# Altium schematic sheet FIT_FPGA_A-C.SchDoc: FIT_PM12 board
size 420 x 297 mm; CheckedBy: G.Kasprowicz; Author: INR Moscow; CompanyName: WUT ISE; DrawnBy: M.Podgórski; Organization: WUT ISE; Address1: PW ISE; Address2: Nowowiejska 15/19 00-665 Warsaw; Address3: gkasprow@gmail.com; Revision: 2; SheetNumber: -; SheetTotal: -; ModifiedBy: -; CheckedDate: -; Title2: Title 2; DivGrp: WUT ISE; Designer: INR RAS; ModifiedDate: -; ProjectName: Sensor Box
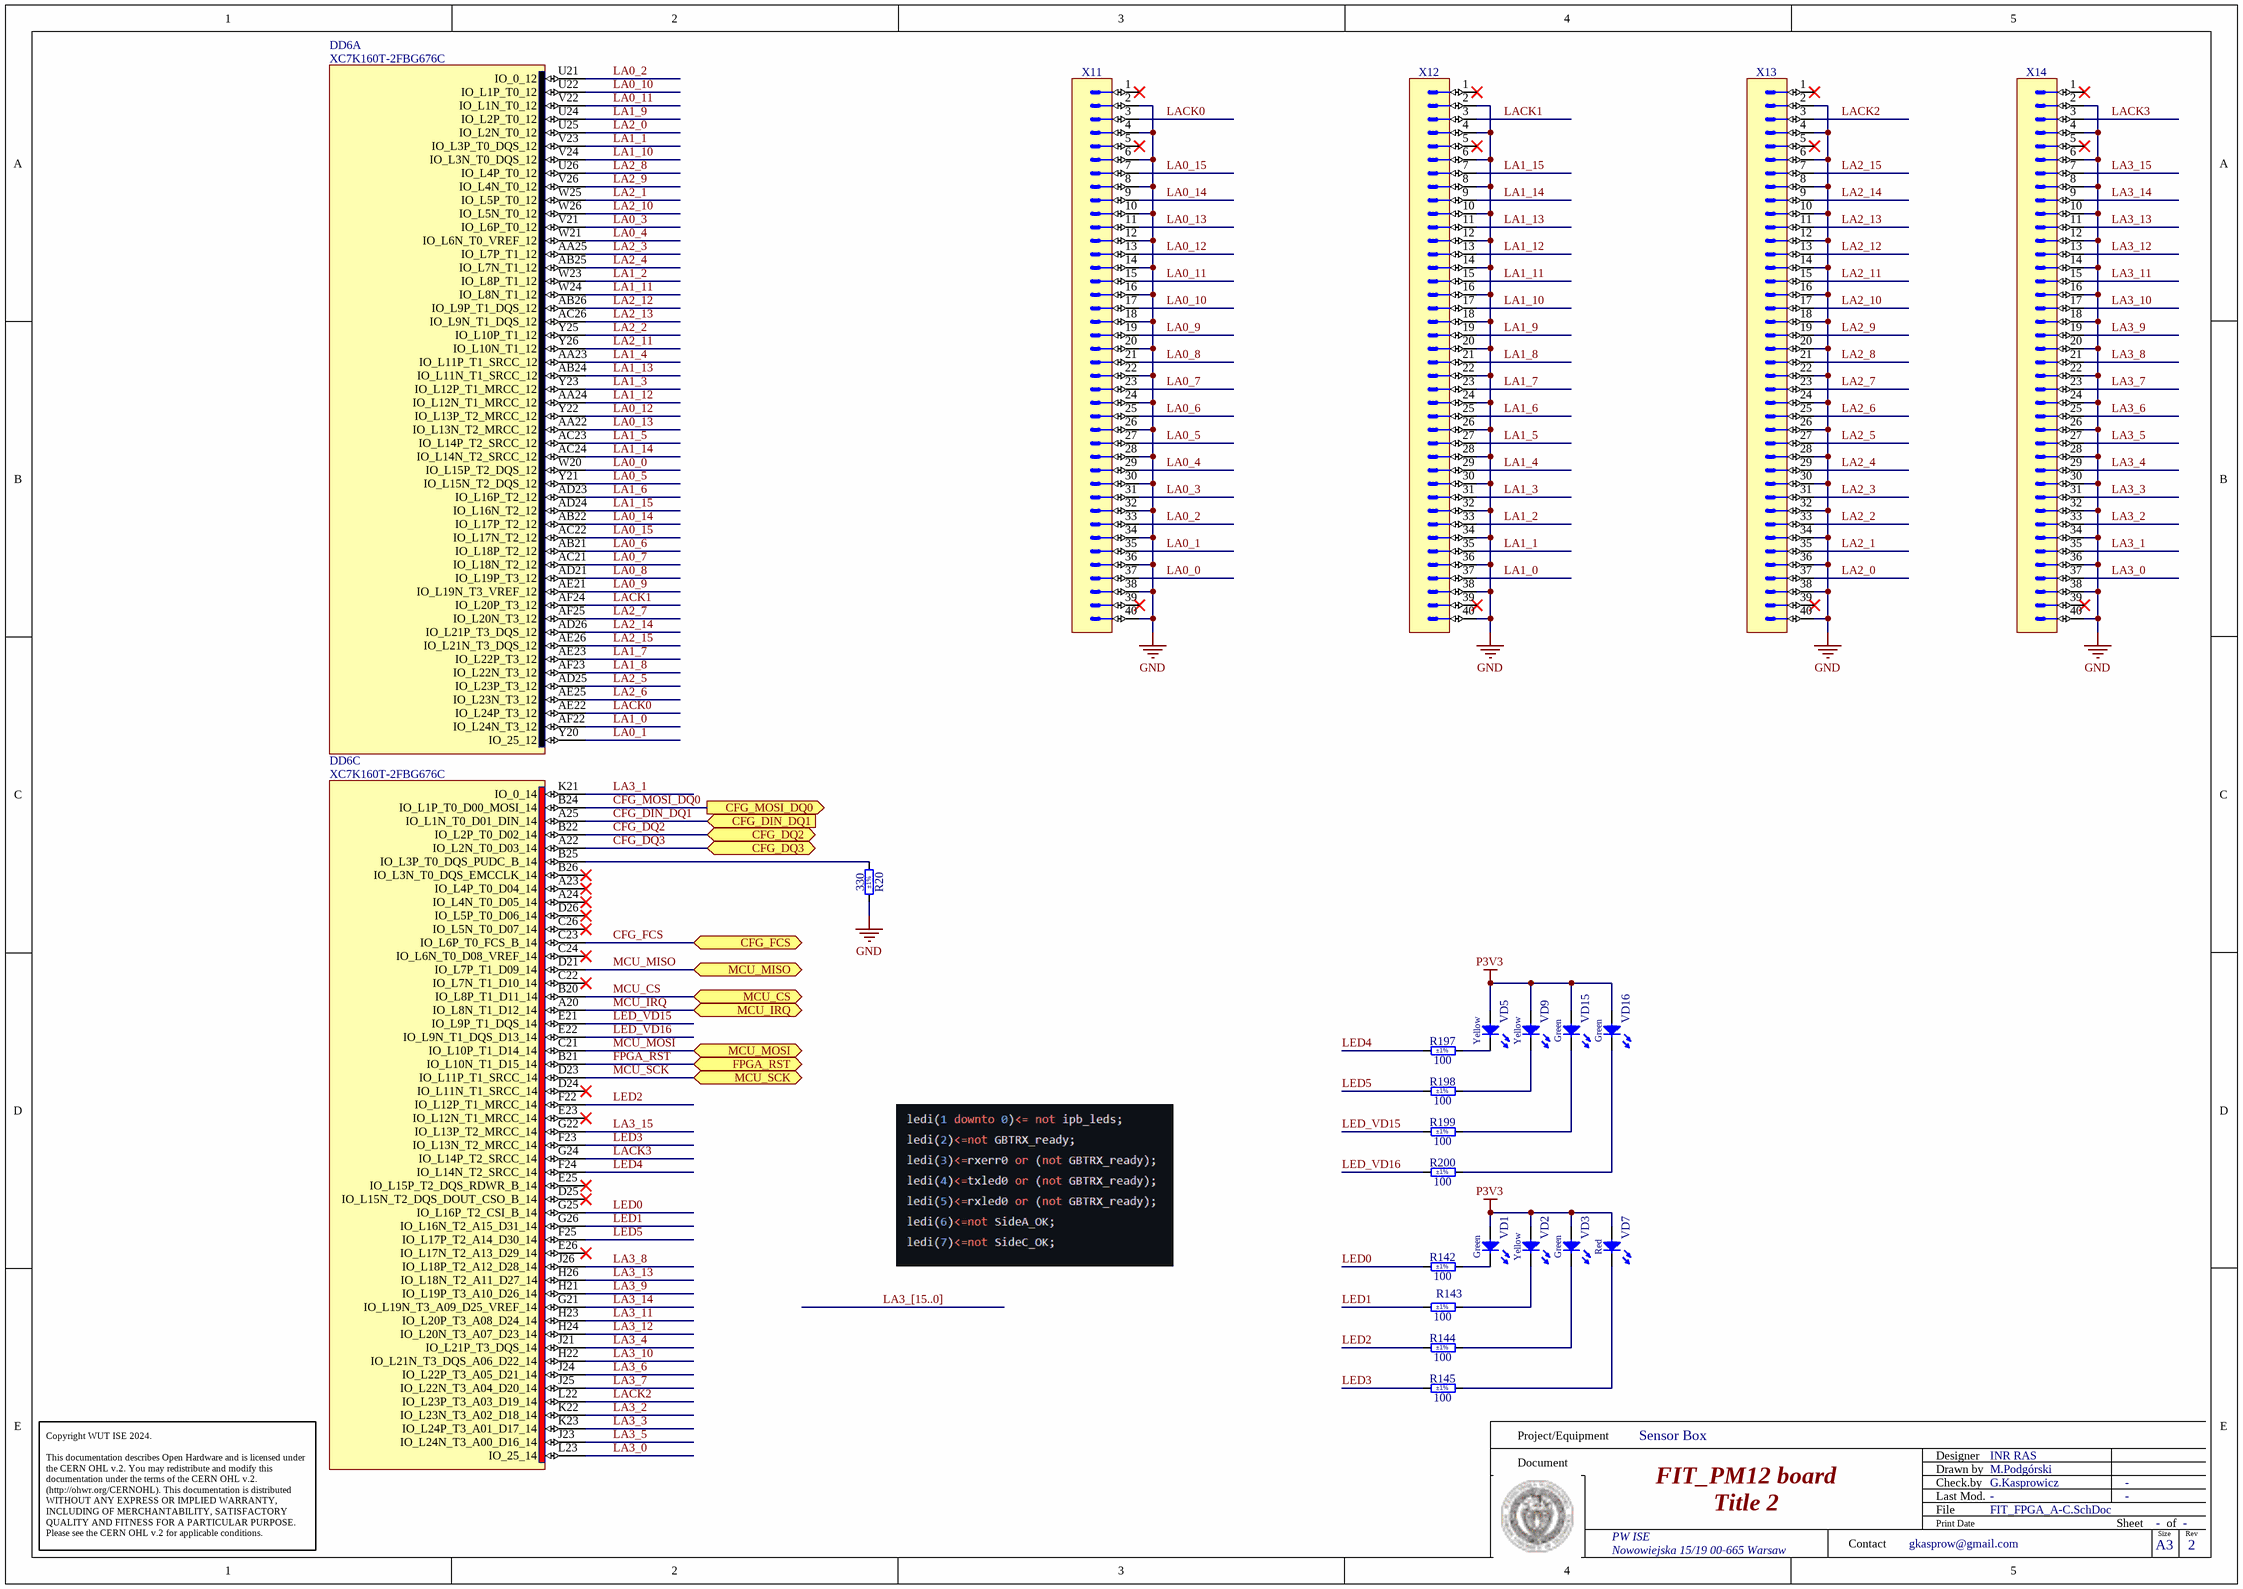
[diagram p0: FIT_FPGA_A-C.SchDoc]

## Parts
DD6  XC7K160T-2FBG676C  [BGA676C100P26X26_2700X2700X254]  (parts A,C of 15)
R20  330  Tolerance: ±1%  [RESC2012X60N]
R142  100  Tolerance: ±1%  [RESC2012X60N]
R143  100  Tolerance: ±1%  [RESC2012X60N]
R144  100  Tolerance: ±1%  [RESC2012X60N]
R145  100  Tolerance: ±1%  [RESC2012X60N]
R197  100  Tolerance: ±1%  [RESC2012X60N]
R198  100  Tolerance: ±1%  [RESC2012X60N]
R199  100  Tolerance: ±1%  [RESC2012X60N]
R200  100  Tolerance: ±1%  [RESC2012X60N]
VD1  Green  [LED_KINGBRIGHT_KP-2012LSGC]
VD2  Yellow  [LED_KINGBRIGHT_KPT-2012YC]
VD3  Green  [LED_KINGBRIGHT_KP-2012LSGC]
VD5  Yellow  [LED_KINGBRIGHT_KPT-2012YC]
VD7  Red  [LED_KINGBRIGHT_KPT-2012SURCK]
VD9  Yellow  [LED_KINGBRIGHT_KPT-2012YC]
VD15  Green  [LED_KINGBRIGHT_KP-2012LSGC]
VD16  Green  [LED_KINGBRIGHT_KP-2012LSGC]
X11  (no value)  [CONNFLY_DS1013-40SSIB1-B-0]
X12  (no value)  [CONNFLY_DS1013-40SSIB1-B-0]
X13  (no value)  [CONNFLY_DS1013-40SSIB1-B-0]
X14  (no value)  [CONNFLY_DS1013-40SSIB1-B-0]

## Ports
CFG_DIN_DQ1 (in), CFG_DQ2 (bidir), CFG_DQ3 (bidir), CFG_FCS (bidir), CFG_MOSI_DQ0 (out), FPGA_RST (bidir), MCU_CS (bidir), MCU_IRQ (bidir), MCU_MISO (bidir), MCU_MOSI (bidir), MCU_SCK (bidir)

## Nets
GND: R20.2 X11.2 X11.4 X11.6 X11.8 X11.10 X11.12 X11.14 X11.16 X11.18 X11.20 X11.22 X11.24 X11.26 X11.28 X11.30 X11.32 X11.34 X11.36 X11.38 X11.40 X12.2 X12.4 X12.6 X12.8 X12.10 X12.12 X12.14 X12.16 X12.18 X12.20 X12.22 X12.24 X12.26 X12.28 X12.30 X12.32 X12.34 X12.36 X12.38 X12.40 X13.2 X13.4 X13.6 X13.8 X13.10 X13.12 X13.14 X13.16 X13.18 X13.20 X13.22 X13.24 X13.26 X13.28 X13.30 X13.32 X13.34 X13.36 X13.38 X13.40 X14.2 X14.4 X14.6 X14.8 X14.10 X14.12 X14.14 X14.16 X14.18 X14.20 X14.22 X14.24 X14.26 X14.28 X14.30 X14.32 X14.34 X14.36 X14.38 X14.40
P3V3: VD1.2(A) VD2.2(A) VD3.2(A) VD5.2(A) VD7.2(A) VD9.2(A) VD15.2(A) VD16.2(A)
CFG_DIN_DQ1: DD6.A25(IO_L1N_T0_D01_DIN_14) ; port CFG_DIN_DQ1
CFG_DQ2: DD6.B22(IO_L2P_T0_D02_14) ; port CFG_DQ2
CFG_DQ3: DD6.A22(IO_L2N_T0_D03_14) ; port CFG_DQ3
CFG_FCS: DD6.C23(IO_L6P_T0_FCS_B_14) ; port CFG_FCS
CFG_MOSI_DQ0: DD6.B24(IO_L1P_T0_D00_MOSI_14) ; port CFG_MOSI_DQ0
FPGA_RST: DD6.B21(IO_L10N_T1_D15_14) ; port FPGA_RST
LA0_0: DD6.W20(IO_L15P_T2_DQS_12) X11.37
LA0_1: DD6.Y20(IO_25_12) X11.35
LA0_2: DD6.U21(IO_0_12) X11.33
LA0_3: DD6.V21(IO_L6P_T0_12) X11.31
LA0_4: DD6.W21(IO_L6N_T0_VREF_12) X11.29
LA0_5: DD6.Y21(IO_L15N_T2_DQS_12) X11.27
LA0_6: DD6.AB21(IO_L18P_T2_12) X11.25
LA0_7: DD6.AC21(IO_L18N_T2_12) X11.23
LA0_8: DD6.AD21(IO_L19P_T3_12) X11.21
LA0_9: DD6.AE21(IO_L19N_T3_VREF_12) X11.19
LA0_10: DD6.U22(IO_L1P_T0_12) X11.17
LA0_11: DD6.V22(IO_L1N_T0_12) X11.15
LA0_12: DD6.Y22(IO_L13P_T2_MRCC_12) X11.13
LA0_13: DD6.AA22(IO_L13N_T2_MRCC_12) X11.11
LA0_14: DD6.AB22(IO_L17P_T2_12) X11.9
LA0_15: DD6.AC22(IO_L17N_T2_12) X11.7
LA1_0: DD6.AF22(IO_L24N_T3_12) X12.37
LA1_1: DD6.V23(IO_L3P_T0_DQS_12) X12.35
LA1_2: DD6.W23(IO_L8P_T1_12) X12.33
LA1_3: DD6.Y23(IO_L12P_T1_MRCC_12) X12.31
LA1_4: DD6.AA23(IO_L11P_T1_SRCC_12) X12.29
LA1_5: DD6.AC23(IO_L14P_T2_SRCC_12) X12.27
LA1_6: DD6.AD23(IO_L16P_T2_12) X12.25
LA1_7: DD6.AE23(IO_L22P_T3_12) X12.23
LA1_8: DD6.AF23(IO_L22N_T3_12) X12.21
LA1_9: DD6.U24(IO_L2P_T0_12) X12.19
LA1_10: DD6.V24(IO_L3N_T0_DQS_12) X12.17
LA1_11: DD6.W24(IO_L8N_T1_12) X12.15
LA1_12: DD6.AA24(IO_L12N_T1_MRCC_12) X12.13
LA1_13: DD6.AB24(IO_L11N_T1_SRCC_12) X12.11
LA1_14: DD6.AC24(IO_L14N_T2_SRCC_12) X12.9
LA1_15: DD6.AD24(IO_L16N_T2_12) X12.7
LA2_0: DD6.U25(IO_L2N_T0_12) X13.37
LA2_1: DD6.W25(IO_L5P_T0_12) X13.35
LA2_2: DD6.Y25(IO_L10P_T1_12) X13.33
LA2_3: DD6.AA25(IO_L7P_T1_12) X13.31
LA2_4: DD6.AB25(IO_L7N_T1_12) X13.29
LA2_5: DD6.AD25(IO_L23P_T3_12) X13.27
LA2_6: DD6.AE25(IO_L23N_T3_12) X13.25
LA2_7: DD6.AF25(IO_L20N_T3_12) X13.23
LA2_8: DD6.U26(IO_L4P_T0_12) X13.21
LA2_9: DD6.V26(IO_L4N_T0_12) X13.19
LA2_10: DD6.W26(IO_L5N_T0_12) X13.17
LA2_11: DD6.Y26(IO_L10N_T1_12) X13.15
LA2_12: DD6.AB26(IO_L9P_T1_DQS_12) X13.13
LA2_13: DD6.AC26(IO_L9N_T1_DQS_12) X13.11
LA2_14: DD6.AD26(IO_L21P_T3_DQS_12) X13.9
LA2_15: DD6.AE26(IO_L21N_T3_DQS_12) X13.7
LA3_0: DD6.L23(IO_25_14) X14.37
LA3_1: DD6.K21(IO_0_14) X14.35
LA3_2: DD6.K22(IO_L23N_T3_A02_D18_14) X14.33
LA3_3: DD6.K23(IO_L24P_T3_A01_D17_14) X14.31
LA3_4: DD6.J21(IO_L21P_T3_DQS_14) X14.29
LA3_5: DD6.J23(IO_L24N_T3_A00_D16_14) X14.27
LA3_6: DD6.J24(IO_L22P_T3_A05_D21_14) X14.25
LA3_7: DD6.J25(IO_L22N_T3_A04_D20_14) X14.23
LA3_8: DD6.J26(IO_L18P_T2_A12_D28_14) X14.21
LA3_9: DD6.H21(IO_L19P_T3_A10_D26_14) X14.19
LA3_10: DD6.H22(IO_L21N_T3_DQS_A06_D22_14) X14.17
LA3_11: DD6.H23(IO_L20P_T3_A08_D24_14) X14.15
LA3_12: DD6.H24(IO_L20N_T3_A07_D23_14) X14.13
LA3_13: DD6.H26(IO_L18N_T2_A11_D27_14) X14.11
LA3_14: DD6.G21(IO_L19N_T3_A09_D25_VREF_14) X14.9
LA3_15: DD6.G22(IO_L13P_T2_MRCC_14) X14.7
LACK0: DD6.AE22(IO_L24P_T3_12) X11.3
LACK1: DD6.AF24(IO_L20P_T3_12) X12.3
LACK2: DD6.L22(IO_L23P_T3_A03_D19_14) X13.3
LACK3: DD6.G24(IO_L14P_T2_SRCC_14) X14.3
LED0: DD6.G25(IO_L16P_T2_CSI_B_14) R142.1
LED1: DD6.G26(IO_L16N_T2_A15_D31_14) R143.1
LED2: DD6.F22(IO_L12P_T1_MRCC_14) R144.1
LED3: DD6.F23(IO_L13N_T2_MRCC_14) R145.1
LED4: DD6.F24(IO_L14N_T2_SRCC_14) R197.1
LED5: DD6.F25(IO_L17P_T2_A14_D30_14) R198.1
LED_VD15: DD6.E21(IO_L9P_T1_DQS_14) R199.1
LED_VD16: DD6.E22(IO_L9N_T1_DQS_D13_14) R200.1
MCU_CS: DD6.B20(IO_L8P_T1_D11_14) ; port MCU_CS
MCU_IRQ: DD6.A20(IO_L8N_T1_D12_14) ; port MCU_IRQ
MCU_MISO: DD6.D21(IO_L7P_T1_D09_14) ; port MCU_MISO
MCU_MOSI: DD6.C21(IO_L10P_T1_D14_14) ; port MCU_MOSI
MCU_SCK: DD6.D23(IO_L11P_T1_SRCC_14) ; port MCU_SCK
NetDD6_B25: DD6.B25(IO_L3P_T0_DQS_PUDC_B_14) R20.1
NetR142_2: R142.2 VD1.1(C)
NetR143_2: R143.2 VD2.1(C)
NetR144_2: R144.2 VD3.1(C)
NetR145_2: R145.2 VD7.1(C)
NetR197_2: R197.2 VD5.1(C)
NetR198_2: R198.2 VD9.1(C)
NetR199_2: R199.2 VD15.1(C)
NetR200_2: R200.2 VD16.1(C)

Not connected (* = marked no-connect by the designer): DD6 A23(IO_L4P_T0_D04_14)* A24(IO_L4N_T0_D05_14)* B26(IO_L3N_T0_DQS_EMCCLK_14)* C22(IO_L7N_T1_D10_14)* C24(IO_L6N_T0_D08_VREF_14)* C26(IO_L5N_T0_D07_14)* D24(IO_L11N_T1_SRCC_14)* D25(IO_L15N_T2_DQS_DOUT_CSO_B_14)* D26(IO_L5P_T0_D06_14)* E23(IO_L12N_T1_MRCC_14)* E25(IO_L15P_T2_DQS_RDWR_B_14)* E26(IO_L17N_T2_A13_D29_14)*; X11 1* 5* 39*; X12 1* 5* 39*; X13 1* 5* 39*; X14 1* 5* 39*

## Buses and harness runs
bus LA3_[15..0]

## Notes on the sheet
- Project/Equipment
- Document
- Designer
- Drawn by
- Check.by
- Copyright WUT ISE 2024.
  This documentation describes Open Hardware and is licensed under the CERN OHL v.2. You may redistribute and modify this documentation under the terms of the CERN OHL v.2. (http://ohwr.org/CERNOHL). This documentation is distributed WITHOUT ANY EXPRESS OR IMPLIED WARRANTY, INCLUDING OF MERCHANTABILITY, SATISFACTORY QUALITY AND FITNESS FOR A PARTICULAR PURPOSE. Please see the CERN OHL v.2 for applicable conditions.
- Contact
- File
- Last Mod.
- Print Date
- Sheet
- Size
- A3
- of
- Rev

## Library data of the parts
DD6 = XC7K160T-2FBG676C: KINTEX-7, FPGA, 676-Ball BGA, Pb-Free; Part Description: KINTEX-7 FPGA, 162240 Logic Cells, 400 User I/O, 8 GTXs, 676-Ball BGA, Speed Grade 2, Commercial Grade, Pb-Free; Manufacturer: XILINX; PressFit: No; Bonding: No; Part Number: XC7K160T-2FBG676C; Component Kind: Standard; Component Type: Standard; Device: XC7K160T-2FBG676C; PackageDescription: BGA, 1.00mm Pitch, Square; 676 Pin, 26 Columns X 26 Rows, Body 27.0mm X 27.0mm X 2.54mm H, IPC Medium Density; Manufacturer Part Number: XC7K160T-2FBG676C; Pin Count: 676; Case: BGA676; Mounted: Yes; Socket: No; SMD: Yes; Sense: No; ComponentHeight: 2.54mm; HelpURL: \\cern.ch\dfs\Applications\Altium\Datasheets\XC7K160T-xFBG676C.pdf; ComponentLink1URL: \\cern.ch\dfs\Applications\Altium\Datasheets\XC7K160T-xFBG676C_Package-Pinout.pdf; ComponentLink1Description: Package/Pinout; Author: CERN DEM BC; CreateDate: 06.02.2020; LatestRevisionDate: 06.02.2020
R20 = R0805_330R_1%_0.125W_100PPM: Resistor - 1%; Part Description: General Purpose Thick Film Chip Resistor; Manufacturer: GENERIC; Manufacturer1 Part Number: NRC10F3300TRF; Power: 0.125W; TC: ±100ppm/°C; PressFit: No; Part Number: R0805_330R_1%_0.125W_100PPM; Component Kind: Standard; Component Type: Standard; Pin Count: 2; Value: 330; Status: Preferred; Manufacturer Part Number: R0805_330R_1%_0.125W_100PPM; Case: 0805; Mounted: Yes; Sense: No; Socket: No; SMD: Yes; Manufacturer1 Example: NIC COMPONENT; Manufacturer1 ComponentHeight: 0.6mm; HelpURL: \\cern.ch\dfs\Applications\Altium\Datasheets\R0805_NIC_NRC.pdf; Author: CERN DEM JLC; CreateDate: 03.12.2007; LatestRevisionDate: 13.03.2008
R142-R145 R197-R200 = R0805_100R_1%_0.125W_100PPM: Resistor - 1%; Part Description: General Purpose Thick Film Chip Resistor; Manufacturer: GENERIC; Manufacturer1 Part Number: NRC10F4700TRF; Power: 0.125W; TC: ±100ppm/°C; PressFit: No; Part Number: R0805_100R_1%_0.125W_100PPM; Component Kind: Standard; Component Type: Standard; Pin Count: 2; Value: 100; Status: Preferred; Manufacturer Part Number: R0805_100R_1%_0.125W_100PPM; Case: 0805; Mounted: Yes; Sense: No; Socket: No; SMD: Yes; Manufacturer1 Example: NIC COMPONENT; Manufacturer1 ComponentHeight: 0.6mm; HelpURL: \\cern.ch\dfs\Applications\Altium\Datasheets\R0805_NIC_NRC.pdf; Author: CERN DEM JLC; CreateDate: 03.12.2007; LatestRevisionDate: 13.03.2008
VD1 VD3 VD15 VD16 = LED_KINGBRIGHT_KP-2012LSGC: LED Green 1C 2A; Part Description: 2.0x1.2mm Surface Mount Green LED; PressFit: No; Bonding: No; Part Number: LED_KINGBRIGHT_KP-2012LSGC; Component Kind: Standard; Component Type: Standard; Color: Green; PackageDescription: 2.0x1.2mm Surface Mount Green LED; Manufacturer: KINGBRIGHT; Manufacturer Part Number: KP-2012LSGC; Pin Count: 2; Case: 0805; Mounted: Yes; Socket: No; SMD: Yes; Sense: No; ComponentHeight: 1.1mm; HelpURL: \\cern.ch\dfs\Applications\Altium\Datasheets\LED_KINGBRIGHT_KP-2012LSGC.pdf; Author: CERN DEM BC; CreateDate: 09.11.2020; LatestRevisionDate: 09.11.2020
VD2 VD5 VD9 = LED_KINGBRIGHT_KPT-2012YC: LED Yellow 1C 2A; Part Description: 2.0X1.25mm, SMD Yellow Chip LED Lamp, KPT-2012 Series; PressFit: No; Bonding: No; Part Number: LED_KINGBRIGHT_KPT-2012YC; Component Kind: Standard; Component Type: Standard; Color: Yellow; PackageDescription: SMT Yellow LED, Case 2012, Body L 2.00mm X  W 1.25mm X H 0.75mm; Manufacturer: KINGBRIGHT; Manufacturer Part Number: KPT-2012YC; Pin Count: 2; Case: 0805; Mounted: Yes; Socket: No; SMD: Yes; Sense: No; ComponentHeight: 0.75mm; HelpURL: \\cern.ch\dfs\Applications\Altium\Datasheets\LED_KINGBRIGHT_KPT-2012YC.pdf; Author: CERN DEM JMW; CreateDate: 24.08.2021; LatestRevisionDate: 24.08.2021
VD7 = LED_KINGBRIGHT_KPT-2012SURCK: LED Red 1C 2A; Part Description: 2.0X1.25mm, SMD Hyper Red Chip LED Lamp, KPT-2012 Series; PressFit: No; Bonding: No; Part Number: LED_KINGBRIGHT_KPT-2012SURCK; Component Kind: Standard; Component Type: Standard; Color: Red; PackageDescription: SMT Hyper Red LED, Case 2012, Body L 2.00mm X  W 1.25mm X H 0.75mm; Manufacturer: KINGBRIGHT; Manufacturer Part Number: KPT-2012SURCK; Pin Count: 2; Case: 0805; Mounted: Yes; Socket: No; SMD: Yes; Sense: No; ComponentHeight: 0.75mm; HelpURL: \\cern.ch\dfs\Applications\Altium\Datasheets\LED_KINGBRIGHT_KPT-2012SURCK.pdf; Author: CERN DEM BC; CreateDate: 06.11.2020; LatestRevisionDate: 06.11.2020
X11-X14 = CONNFLY_DS1013-40SSIB1-B-0: Connector 40 Male; Part Description: 40 Contacts, 2.54mm Box Header V/T,R/A & SMT Type; PressFit: No; Part Number: CONNFLY_DS1013-40SSIB1-B-0; Component Kind: Standard; Component Type: Standard; Pin Count: 40; Mounted: Yes; Socket: No; SMD: No; Sense: No; Status: None; Manufacturer: CONNFLY; Manufacturer Part Number: DS1013-40SSIB1-B-0; ComponentHeight: 9.1mm; HelpURL: \\cern.ch\dfs\Applications\Altium\Datasheets\CONNFLY_DS1013.pdf; Author: CERN DEM HF; CreateDate: 30.05.2024; LatestRevisionDate: 30.05.2024